# EAGLE design PCB_OnOnfre_SINGLE_BETA1 Solenoid (EAGLE 9.2.0)
CNAME: BH ONOFRE; CREVISION: 5.1; DESIGNER: BrunoHorta
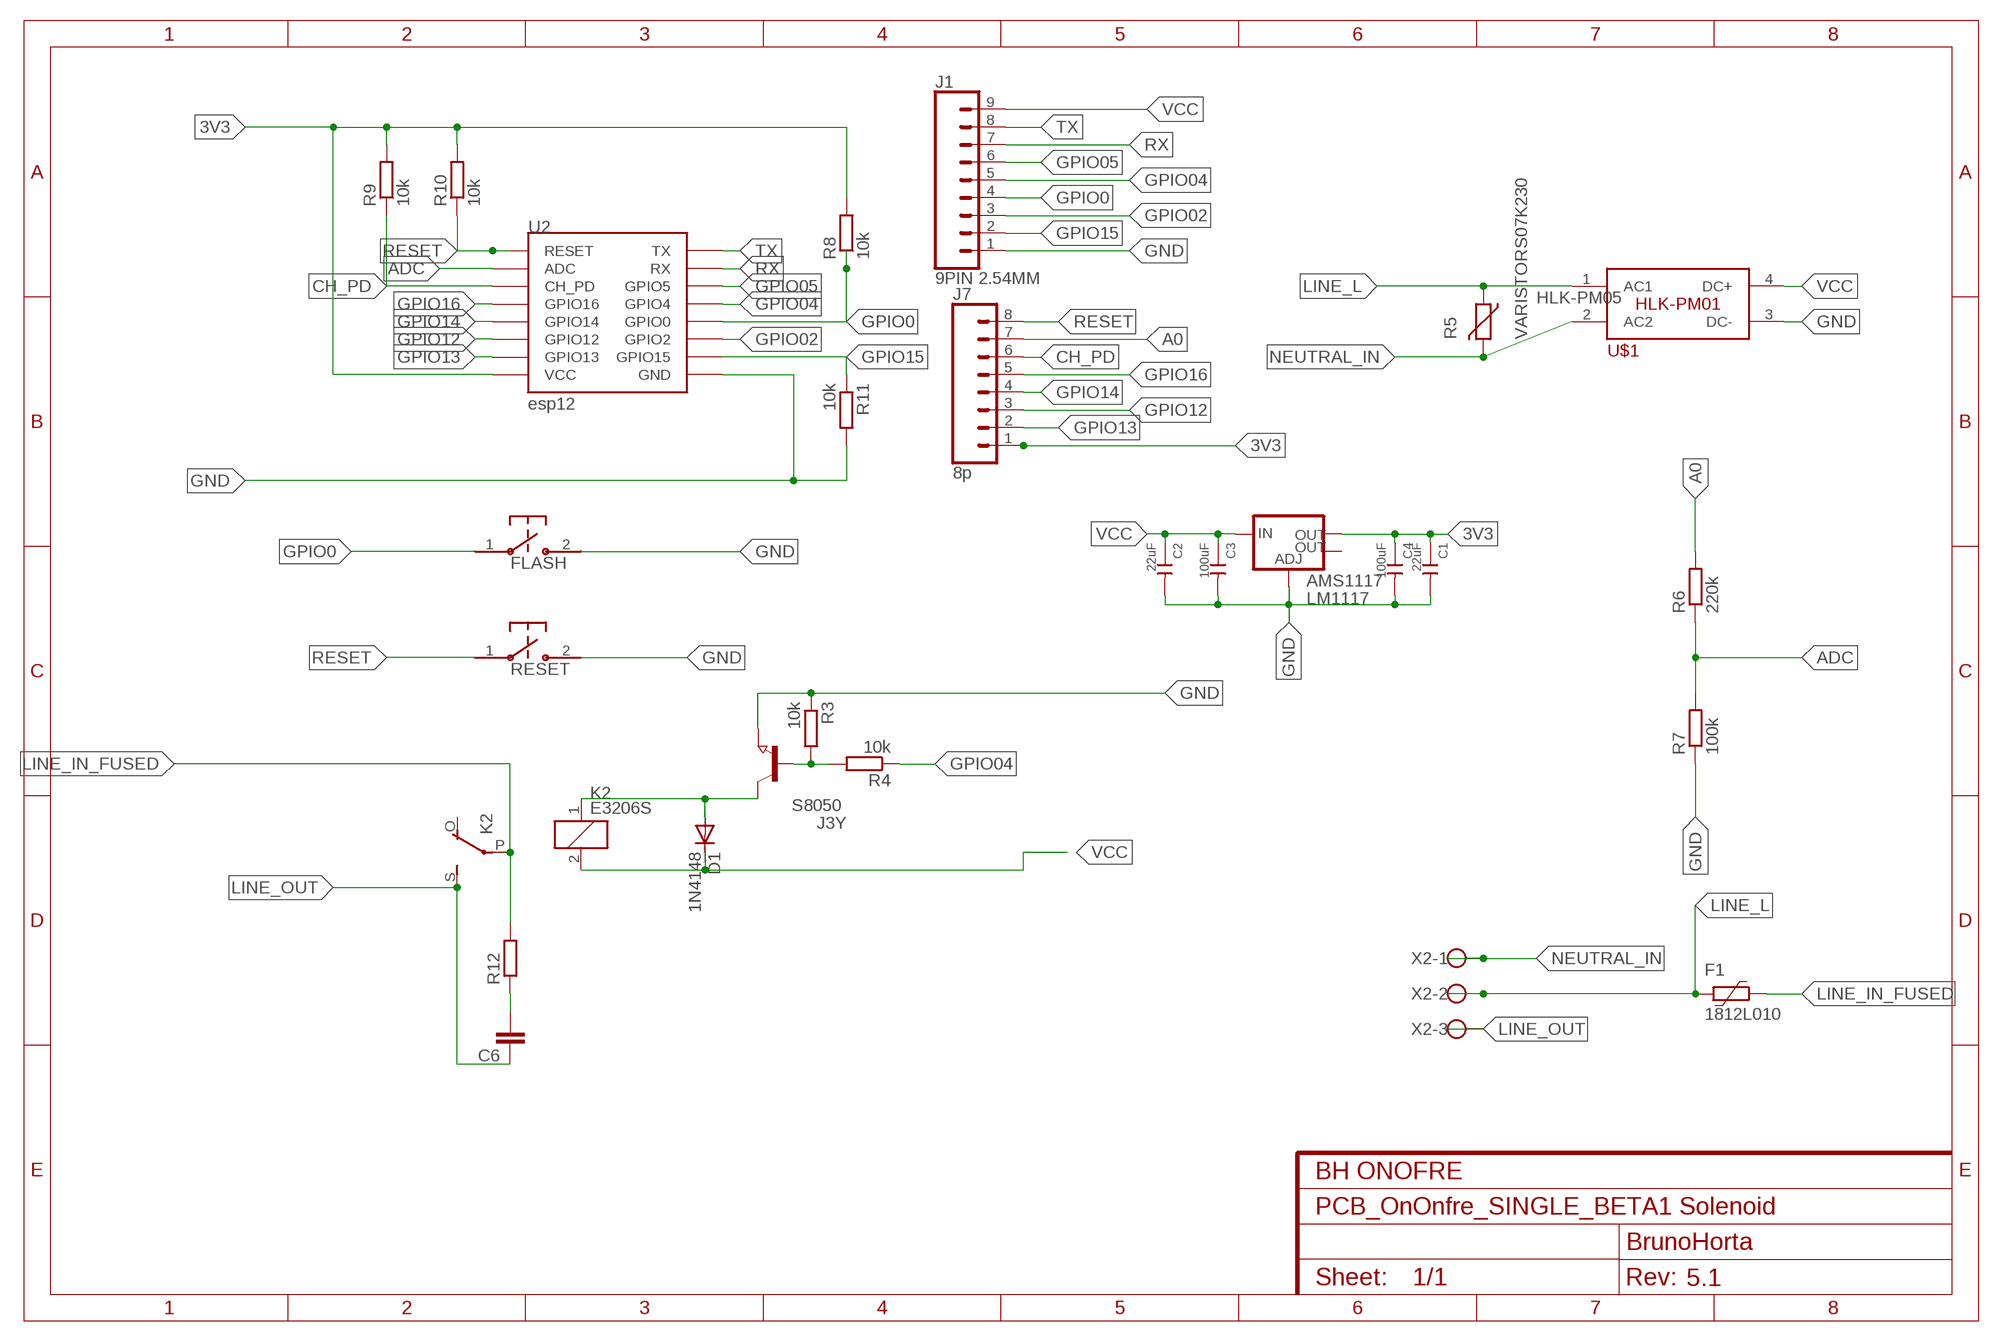
[diagram p0: schematic, sheet 1]

## Parts
AMS1117  LM1117  V_REG_LM1117SOT223  [SOT223]
C1  22uF  CERAMIC-1NF-1KV-10%-X7R(1206)  [C1206]
C2  22uF  CERAMIC-1NF-1KV-10%-X7R(1206)  [C1206]
C3  100uF  CERAMIC-1NF-1KV-10%-X7R(1206)  [C1206]
C4  100uF  CERAMIC-1NF-1KV-10%-X7R(1206)  [C1206]
C6  C-EU102-043X133  [C102-043X133]
D1  1N4148  DIODE-SOD80C  [SOD80C]
F1  1812L010  [1812L]
FLASH  B3U-1000P-2P-SMD  B3U-1000P  [B3U-1000P]
J1  9PIN 2.54MM  CONN_09  [1X09]
J3Y  S8050  NPN-TRANSISTOR_SOT23  [SOT23]
J7  8p  CONN_08"  [1X08]
K2  E3206S  [E3206S]
R3  10k  R-EU_R0603  [R0603]
R4  10k  R-EU_R0603  [R0603]
R5  VARISTORS07K230  [S07K230]
R6  220k  R-EU_R0603  [R0603]
R7  100k  R-EU_R0603  [R0603]
R8  10k  R-EU_R0603  [R0603]
R9  10k  R-EU_R0603  [R0603]
R10  10k  R-EU_R0603  [R0603]
R11  10k  R-EU_R0603  [R0603]
R12  R-EU_R2512  [R2512]
RESET  B3U-1000P-2P-SMD  B3U-1000P  [B3U-1000P]
U2  esp12  ESP12SMD  [ESP12-SMD]
U$1  HLK-PM01  [HLK-PM01]
X2  W237-103  [W237-103]

## Nets
3V3: AMS1117.2(OUT) C1.1 C4.1 J7.1 R8.2 R9.2 R10.2 U2.VCC
A0: J7.7 R6.2
ADC: R6.1 R7.2 U2.ADC
CH_PD: J7.6 R9.1 U2.CH_PD
GND: AMS1117.1(ADJ) C1.2 C2.2 C3.2 C4.2 FLASH.2 J1.1 J3Y.2(E) R3.1 R7.1 R11.2 RESET.2 U2.GND U$1.3(DC-)
GPIO0: FLASH.1 J1.4 R8.1 U2.GPIO0
GPIO02: J1.3 U2.GPIO2
GPIO04: J1.5 R4.1 U2.GPIO4
GPIO05: J1.6 U2.GPIO5
GPIO12: J7.3 U2.GPIO12
GPIO13: J7.2 U2.GPIO13
GPIO14: J7.4 U2.GPIO14
GPIO15: J1.2 R11.1 U2.GPIO15
GPIO16: J7.5 U2.GPIO16
LINE_IN_FUSED [220V]: F1.1 K2.P(2:P) R12.2
LINE_L [220V]: F1.2 R5.1 U$1.1(AC1) X2.2
LINE_OUT [220V]: C6.1 K2.S(2:S) X2.3
N$1: D1.A J3Y.3(C) K2.1
N$5: C6.2 R12.1
N$7: J3Y.1(B) R3.2 R4.2
NEUTRAL_IN [220V]: R5.2 U$1.2(AC2) X2.1
RESET: J7.8 R10.1 RESET.1 U2.RESET
RX: J1.7 U2.RXD0(RX)
TX: J1.8 U2.TXD0(TX)
VCC: AMS1117.3(IN) C2.1 C3.1 D1.C J1.9 K2.2 U$1.4(DC+)
Unconnected: AMS1117.4(OUT) K2.O(2:O)

## Notes on the sheet
- HLK-PM05

## Library data of the parts
AMS1117 = SparkFun-IC-Power:V_REG_LM1117: Voltage Regulator LM1117 Standard adjustable voltage regulator but in SMD form. Spark Fun Electronics SKU : COM-00595; PROD_ID: VREG-08170
C1-C4 = Seeed-Capacitor:CERAMIC-1NF-1KV-10%-X7R?(1206): 302010189; MPN: CC1206KKX7RCBB102; VALUE: 1NF
C6 = rcl:C-EU: CAPACITOR, European symbol; SPICEPREFIX: C
D1 = diode:DIODE-: DIODE
F1 = polyfuse-smd_10:?: Polyfuse Resettable PTC Source: http://www.littelfuse.com/products/resettable-ptcs.aspx; MF: Littelfuse; MPN: 1812L010; OC_FARNELL: 1822210; OC_NEWARK: 78R5551
FLASH RESET = switches:B3U: Switch; DIGIKEY: SW1020CT-ND; MANUFACTURER: Omron; MPN: B3U-1000P
J1 = SparkFun-Connectors:CONN_09: Multi connection point. Often used as Generic Header-pin footprint for 0.1 inch spaced/style header connections On any of the 0.1 inch spaced packages, you can populate with these: Break Away Headers - Straight <https://www.sparkfun.com/products/116> (PRT-00116) Break Away Male Headers - Right Angle <https://www.sparkfun.com/products/553> (PRT-00553) Female Headers <https://www.sparkfun.com/products/115> (PRT-00115) Break Away Headers - Machine Pin <https://www.sparkfun.com/products/117> (PRT-00117) Break Away Female Headers - Swiss Machine Pin <https://www.sparkfun.com/products/743> (PRT-00743) For SCREWTERMINALS and SPRING TERMINALS visit here: Screw Terimnals on SparkFun.com <https://www.sparkfun.com/search/results?term=Screw+Terminals> (5mm/3.5mm/2.54mm spacing) This device is also useful as a general connection point to wire up your design to another part of your project. Our various solder wires solder well into these plated through hole pads. Hook-Up Wire - Assortment (Stranded, 22 AWG) <https://www.sparkfun.com/products/11375> (PRT-11375) Hook-Up Wire - Assortment (Solid Core, 22 AWG) <https://www.sparkfun.com/products/11367> (PRT-11367) View the entire wire category on our website here <https://www.sparkfun.com/categories/141> Special notes: Molex polarized connector foot print use with SKU : PRT-08231 with associated crimp pins and housings. 1MM SMD Version SKU: PRT-10208 NOTES ON THE VARIANTS LOCK and LOCK_LONGPADS... This footprint was designed to help hold the alignment of a through-hole component (i.e. 6-pin header) while soldering it into place. You may notice that each hole has been shifted either up or down by 0.005 of an inch from it's more standard position (which is a perfectly straight line). This slight alteration caused the pins (the squares in the middle) to touch the edges of the holes. Because they are alternating, it causes a "brace" to hold the component in place. 0.005 has proven to be the perfect amount of "off-center" position when using our standard breakaway headers. Although looks a little odd when you look at the bare footprint, once you have a header in there, the alteration is very hard to notice. Also,if you push a header all the way into place, it is covered up entirely on the bottom side.
J3Y = semicon-smd-ipc:NPN-TRANSISTOR_: NPN TRANSISTOR
J7 = SparkFun-Connectors:CONN_08: Multi connection point. Often used as Generic Header-pin footprint for 0.1 inch spaced/style header connections On any of the 0.1 inch spaced packages, you can populate with these: Break Away Headers - Straight <https://www.sparkfun.com/products/116> (PRT-00116) Break Away Male Headers - Right Angle <https://www.sparkfun.com/products/553> (PRT-00553) Female Headers <https://www.sparkfun.com/products/115> (PRT-00115) Break Away Headers - Machine Pin <https://www.sparkfun.com/products/117> (PRT-00117) Break Away Female Headers - Swiss Machine Pin <https://www.sparkfun.com/products/743> (PRT-00743) Arduino Stackable Header - 8 Pin <https://www.sparkfun.com/products/9279> (PRT-09279) For SCREWTERMINALS and SPRING TERMINALS visit here: Screw Terimnals on SparkFun.com <https://www.sparkfun.com/search/results?term=Screw+Terminals> (5mm/3.5mm/2.54mm spacing) This device is also useful as a general connection point to wire up your design to another part of your project. Our various solder wires solder well into these plated through hole pads. Hook-Up Wire - Assortment (Stranded, 22 AWG) <https://www.sparkfun.com/products/11375> (PRT-11375) Hook-Up Wire - Assortment (Solid Core, 22 AWG) <https://www.sparkfun.com/products/11367> (PRT-11367) View the entire wire category on our website here <https://www.sparkfun.com/categories/141> Special notes: Molex polarized connector foot print use with SKU : PRT-08231 with associated crimp pins and housings. 1MM SMD Version SKU: PRT-10208 NOTES ON THE VARIANTS LOCK and LOCK_LONGPADS... This footprint was designed to help hold the alignment of a through-hole component (i.e. 6-pin header) while soldering it into place. You may notice that each hole has been shifted either up or down by 0.005 of an inch from it's more standard position (which is a perfectly straight line). This slight alteration caused the pins (the squares in the middle) to touch the edges of the holes. Because they are alternating, it causes a "brace" to hold the component in place. 0.005 has proven to be the perfect amount of "off-center" position when using our standard breakaway headers. Although looks a little odd when you look at the bare footprint, once you have a header in there, the alteration is very hard to notice. Also,if you push a header all the way into place, it is covered up entirely on the bottom side.; PROD_ID: CONN-08438
K2 = relay:E3206S: RELAY 1 x switch, Eichhoff/distributor Schukat; OC_FARNELL: unknown; OC_NEWARK: unknown
R3 R4 R6-R12 = resistor:R-EU_: RESISTOR, European symbol
R5 = varistor:VARISTOR: VARISTOR
U2 = esp8266modules:ESP12: ESP8266 Wifi module 12
U$1 = HLK-PM01:HLK-PM01; AVAILABILITY: Unavailable; MF: Hi-link; MP: hlk-pm01; PACKAGE: Package Analog Devices; PRICE: None
X2 = con-wago-500:W237-103: WAGO SCREW CLAMP; MPN: 237-103; OC_FARNELL: unknown; OC_NEWARK: 18M7116

## Net classes
1 220V: width 1.27 mm, clearance 2 mm

## Board
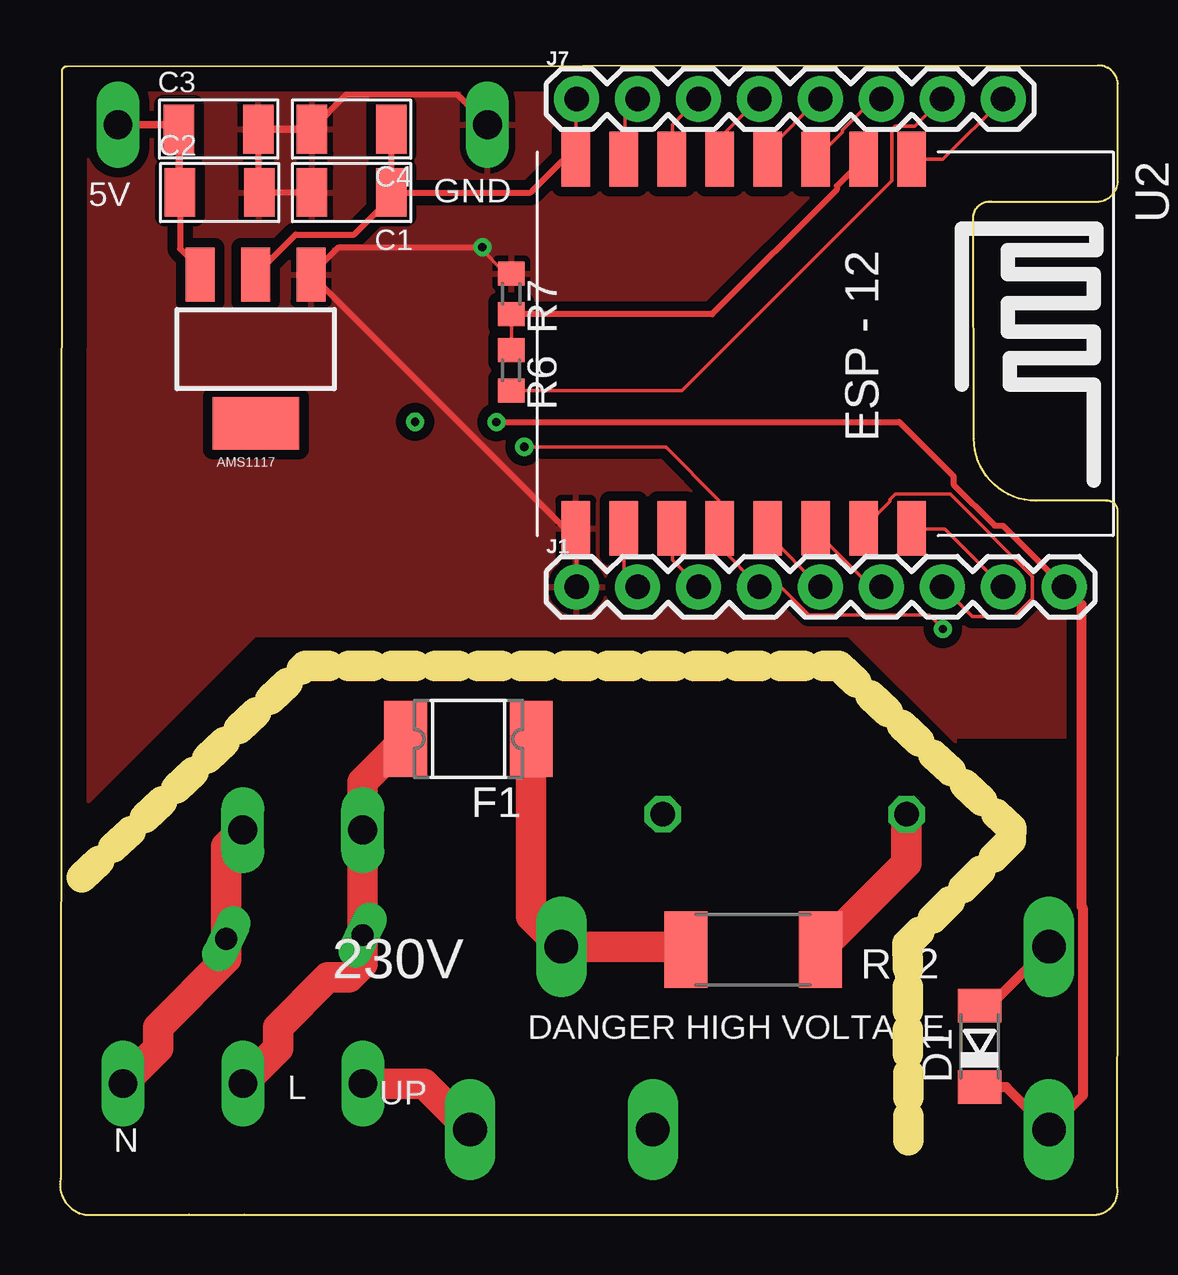
[diagram p1: board, top side]
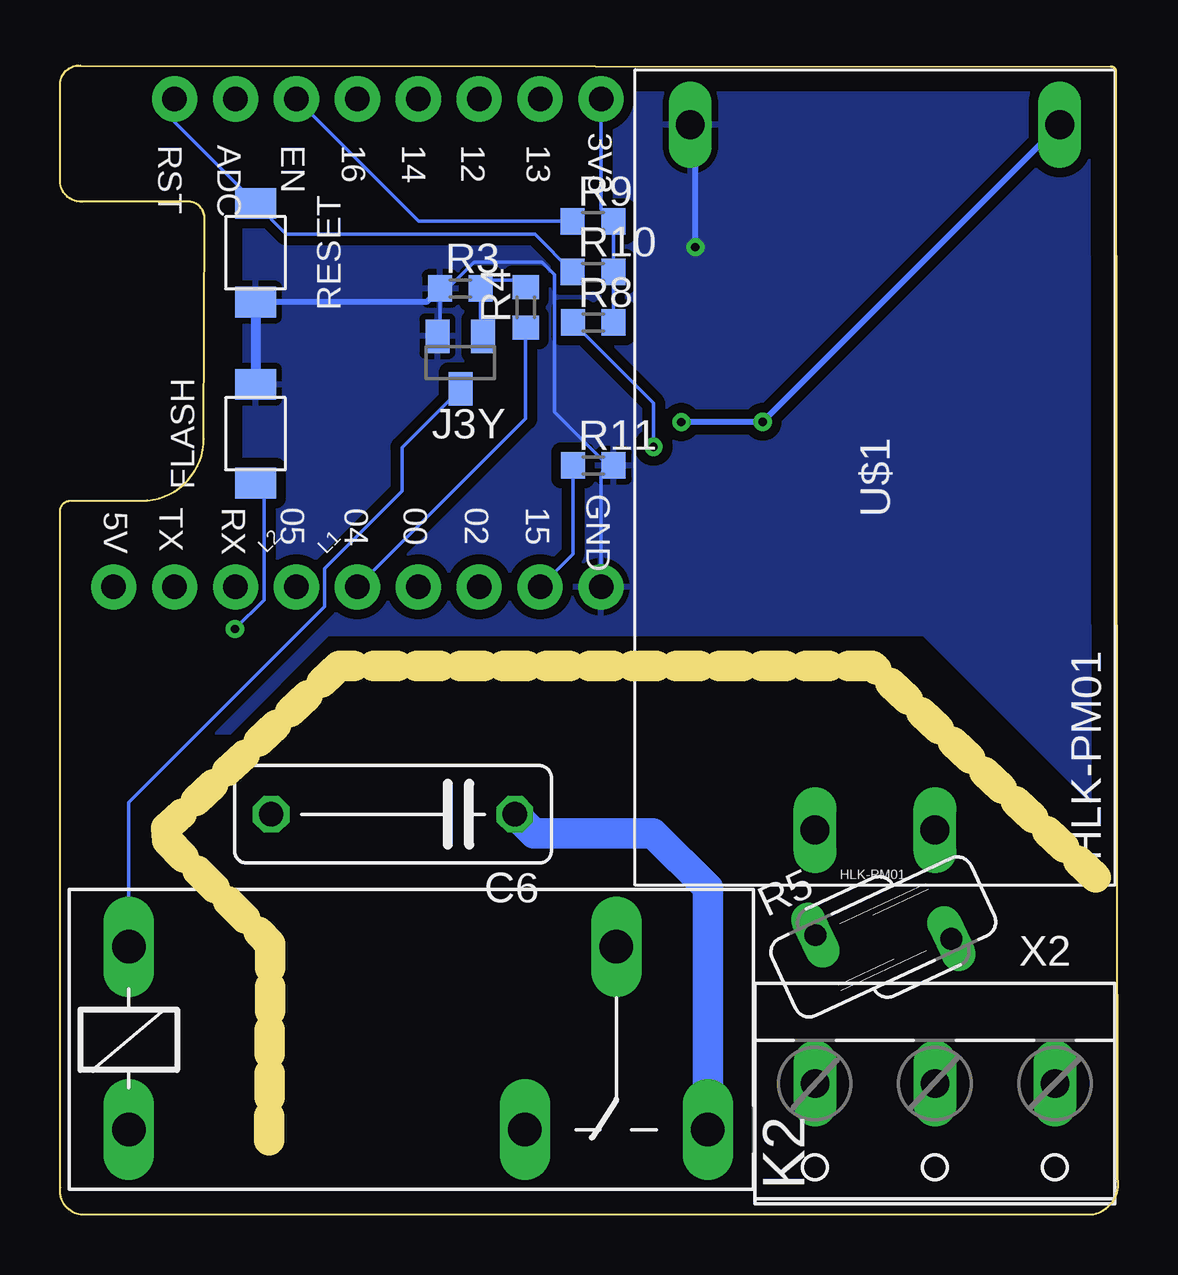
[diagram p2: board, bottom side, seen from below]

Size 44.09 x 47.9 mm. Coordinates in mm from the lower left corner, seen from the top.
Outline: 0.08,47.68 0.02,1.51 arc90 1.03,0 5.38,0 7.68,0 43.23,0 arc90 44.08,1.12 44.09,12.08 44.09,29.35 arc90 43.61,29.76 40.69,29.76 arc-90 38.1,32.35 38.07,41.61 arc-90 38.83,42.23 43.15,42.22 arc90 44.09,43.06 44.09,47.15 arc90 43.24,47.9 0.3,47.86 arc90 0.08,47.68
Copper layers (1*16): Top 0.035mm / dielectric 1.5mm / Bottom 0.035mm
Design rules "default": minimum track width 6mil, minimum drill 0.35mm, track to track 6mil, track to pad 6mil, pad to pad 6mil, via to via 6mil, smd to smd 6mil, copper to edge 40mil, drill to drill 6mil, minimum pad ring 10mil, minimum via ring 8mil, stop-mask expansion 4mil, vias tented up to drill 0mil, thermal gap 10mil
Milling: 37 lines

### Footprints (pad centres in the part's own frame; a part is rotated, then mirrored left to right if it is on the bottom)
SOT223 = smd 1.219 x 2.235: 1 -2.311,-3.099; 2 0,-3.099; 3 2.311,-3.099 | smd 3.6 x 2.2: 4 0,3.099
C1206 = smd 1.27 x 2.032: 1 -1.651,0; 2 1.651,0
C102-043X133 = drill 1.016 octagon: 1 -5.08,0; 2 5.08,0
SOD80C = smd 1.4 x 1.8: A 1.7,0; C -1.7,0
1812L = smd 1.78 x 3.15: 1 -2.62,0; 2 2.62,0
B3U-1000P = smd 1.283 x 1.7: 1 -2.056,0; 2 2.056,0
1X09 = drill 1.016 pad 1.88: 1 0,0; 2 2.54,0; 3 5.08,0; 4 7.62,0; 5 10.16,0; 6 12.7,0; 7 15.24,0; 8 17.78,0; 9 20.32,0
SOT23 = smd 1 x 1.4: 1 -0.95,-1.1; 2 0.95,-1.1; 3 0,1.1
1X08 = drill 1.016 pad 1.88: 1 0,0; 2 2.54,0; 3 5.08,0; 4 7.62,0; 5 10.16,0; 6 12.7,0; 7 15.24,0; 8 17.78,0
E3206S = drill 1.397 long: 1 -3.175,3.81; 2 -3.175,-3.81; O 13.335,-3.81; P 17.145,3.81; S 20.955,-3.81
R0603 = smd 1 x 1.1: 1 -0.85,0; 2 0.85,0
S07K230 = drill 0.914 long: 1 -1.27,-2.54; 2 1.27,2.54
R2512 = smd 1.8 x 3.2: 1 -2.8,0; 2 2.8,0
ESP12-SMD = smd 2.286 x 1.2: ADC -7.792,3.8; CH_PD -7.792,1.8; GND 7.592,-8.2; GPIO0 7.592,-2.2; GPIO2 7.592,-4.2; GPIO4 7.592,-0.2; GPIO5 7.592,1.8; GPIO12 -7.792,-4.2; GPIO13 -7.792,-6.2; GPIO14 -7.792,-2.2; GPIO15 7.592,-6.2; GPIO16 -7.792,-0.2; RESET -7.792,5.8; RXD0 7.592,3.8; TXD0 7.592,5.8; VCC -7.792,-8.2
HLK-PM01 = drill 1.2 long: 1 -14.7,2.5; 2 -14.7,-2.5; 3 14.7,7.7; 4 14.7,-7.7
W237-103 = drill 1.194 long: 1 -5,-1.29; 2 0,-1.29; 3 5,-1.29

### Placement (x,y rotation side)
AMS1117  8.16,36.09 180 top
C1  12.16,42.61 180 top
C2  6.66,42.61 0 top
C3  6.61,45.25 0 top
C4  12.16,45.25 180 top
C6  30.21,16.69 180 bottom
D1  38.34,7.02 90 top
F1  17.02,19.83 180 top
FLASH  35.94,32.56 90 bottom
J1  21.54,26.17 0 top
J3Y  27.41,35.52 180 bottom
J7  21.54,46.51 0 top
K2  38.05,7.36 0 bottom
R3  27.4,38.61 0 bottom
R4  24.68,37.82 90 bottom
R5  9.77,11.58 295 bottom
R6  18.81,35.19 270 top
R7  18.81,38.38 270 top
R8  21.86,37.19 0 bottom
R9  21.87,41.41 0 bottom
R10  21.87,39.3 0 bottom
R11  21.86,31.23 0 bottom
R12  28.9,11.05 180 top
RESET  35.94,40.1 270 bottom
U2  29.7,36.2 270 top
U$1  10.12,30.73 90 bottom
X2  7.62,4.17 180 bottom

### Tracks (layer width: path | path; a pad name or v marks a point on that pad's centre or on a via)
3V3
  Top 0.152: U2.VCC 21.5,44.49 21.5,46.47 J7.1 | 13.79,43.2 13.79,42.75 C1.1 13.8,42.78 13.79,43.2
  Top 0.254: C4.1 13.81,42.78 13.8,42.78 | C1.1 14.02,42.61 | 14.02,42.61 19.62,42.61 21.5,44.49 | AMS1117.2 9.83,40.85 12.26,40.85 14.02,42.61
  Bottom 0.152: R8.2 R10.2 21.02,41.4 | 21.02,41.4 R9.2 | R9.2 | J7.1 21.54,41.92 21.02,41.4
A0
  Top 0.152: J7.7 35.64,45.37 34.81,45.37 34.67,45.23 34.67,43.1 25.92,34.34 R6.2
ADC
  Top 0.152: R7.2 R6.1
  Top 0.254: U2.ADC 32.38,42.87 32.38,42.74 27.18,37.53 R7.2
CH_PD
  Top 0.152: U2.CH_PD 31.55,44.06 32.62,45.12 32.62,45.2 33.91,46.49 34.22,46.49 J7.6
  Bottom 0.152: R9.1 29.14,41.41 J7.6
GND  (via drill 0.35)
  Top 0.152: U2.GND arc-90 21.54,28.57 21.54,27.76 J1.1 | R7.1 18.58,39.23 17.48,40.33
  Top 0.254: C4.2 11.95,46.7 16.45,46.7 16.55,46.7 U$1.3 | C3.2 8.26,42.65 C2.2 C1.2 | v17.61,40.33 17.48,40.33 11.62,40.33 AMS1117.1 21.54,28.12 21.54,27.76
  Top 0.305: C3.2 C4.2
  Bottom 0.152: J1.1 21.54,30.8 arc90 R11.2 21.26,31.25 23.47,33.46 23.47,39.18 24.01,39.71 26.82,39.71 27.89,38.64 28.2,38.64 R3.1 28.25,36.72 J3Y.2
  Bottom 0.254: v17.61,40.33 17.61,45.22 U$1.3 | R3.1 28.82,38.04 RESET.2
  Bottom 0.406: RESET.2 FLASH.2
  pour Top (isolate 0.406): 0.26,47.54 0.26,18.16 1.21,17.21 8.14,24.14 32.87,24.14 37.31,19.7 37.31,19.92 42.95,19.92 43.75,20.72 43.75,27.24 42.06,28.93 36.82,28.93 36.82,42.55 38.52,44.24 42.64,44.24 42.6,44.28 42.6,47.58 0.3,47.58
  pour Bottom (isolate 0.406): 0.22,47.5 0.22,17.71 0.92,17.01 8.09,24.19 32.91,24.19 37,20.09 43.71,20.09 43.71,27.28 42.02,28.97 37.07,28.97 36.41,29.63 36.41,42.3 38.39,44.28 42.47,44.28 42.56,44.36 42.56,47.74 0.46,47.74 0.26,47.54
GPIO0  (via drill 0.35)
  Top 0.152: v36.8,24.42 36.72,24.5 36.72,24.52 36.23,25 31.21,25 30.05,26.17 J1.4 27.5,27.83 27.5,28.22 | 27.5,28.22 U2.GPIO0 | v19.35,32.01 25.25,32.01 27.48,29.78 27.48,28.25 27.5,28.22
  Bottom 0.152: FLASH.1 35.59,30.49 35.59,25.63 v36.8,24.42 | R8.1 19.35,33.83 v19.35,32.01
GPIO02
  Top 0.152: U2.GPIO2 25.53,28.59 25.53,27.29 26.6,26.22 J1.3
GPIO04
  Top 0.152: U2.GPIO4 29.57,28.59 29.57,28.28 31.63,26.22 J1.5
  Bottom 0.152: R4.1 24.68,33.18 J1.5
GPIO05
  Top 0.152: U2.GPIO5 31.55,28.59 31.55,28.43 33.76,26.22 34.22,26.22 J1.6
GPIO12
  Top 0.152: U2.GPIO12 25.53,44.06 25.53,45.43 26.6,46.49 J7.3
GPIO13
  Top 0.152: U2.GPIO13 23.55,44.06 23.55,46.04 24.01,46.49 J7.2
GPIO14
  Top 0.152: U2.GPIO14 27.51,44.06 27.51,44.89 29.11,46.49 J7.4
GPIO15
  Top 0.152: U2.GPIO15 23.5,26.75 J1.2
  Bottom 0.152: R11.1 22.71,27.54 J1.2
GPIO16
  Top 0.152: U2.GPIO16 29.57,44.06 29.57,44.44 31.63,46.49 J7.5
LINE_IN_FUSED
  Top 1.27: R12.2 25.99,11.17 K2.P 19.64,12.43 F1.1
LINE_L
  Top 1.27: F1.2 12.62,18.05 U$1.1 12.61,16.02 R5.1 12.61,10.45 12.05,9.89 11.16,9.89 9.09,7.82 9.09,6.93 X2.2
LINE_OUT
  Top 1.27: X2.3 15.18,5.46 K2.S
  Bottom 1.27: C6.1 24.34,15.9 19.38,15.9 17.09,13.61 K2.S
N$1
  Top 0.406: K2.1 38.77,8.72 D1.A
  Bottom 0.152: J3Y.3 29.84,31.99 29.84,30.16 33.06,26.94 33.06,25.36 41.22,17.2 K2.1
N$5
  Top 1.27: C6.2 35.29,14.65 R12.1
N$7
  Bottom 0.152: J3Y.1 26.55,36.71 R3.2 26.52,38.64 26.21,38.95 24.69,38.95 R4.2
NEUTRAL_IN
  Top 1.27: U$1.2 6.93,15.35 R5.2 6.93,10.66 4.09,7.82 4.09,6.93 X2.1
RESET
  Top 0.152: U2.RESET 36.81,43.99 J7.8
  Bottom 0.152: R10.1 24.3,40.88 34.66,40.88 RESET.1 39.32,45.53 J7.8
RX
  Top 0.152: U2.RXD0 33.53,28.66 34.6,29.73 34.6,29.81 34.83,30.03 37.11,30.03 40.54,26.61 40.54,25.69 39.78,24.93 38.03,24.93 36.81,26.15 J1.7
TX
  Top 0.152: U2.TXD0 35.51,28.59 36.88,28.59 39.25,26.22 J1.8
VCC  (via drill 0.35)
  Top 0.152: AMS1117.3 5.85,39.42 5.8,39.47 | C3.1 4.96,45.57 C3.1
  Top 0.254: C2.1 5.01,40.27 5.8,39.47 | v18.19,33.04 34.99,33.04 37.24,30.79 37.24,30.44 38.96,28.72 39.3,28.72 J1.9 42.58,25.45
  Top 0.305: U$1.4 4.66,45.43 C3.1 4.96,42.65 C2.1
  Top 0.406: D1.C 39.45,5.32 K2.2 42.63,4.95 42.63,12.8 42.58,12.84 42.58,25.45
  Bottom 0.254: U$1.4 v14.8,33.05 14.81,33.04 v18.19,33.04

### Text on the board
tNames: 5V | GND | 230V | DANGER HIGH VOLTAGE | UP | L | N
bNames: 3V3 | 13 | 12 | 14 | 16 | EN | ADC | RST | GND | 15 | 02 | 00 | 04 | 05 | RX | TX | 5V | L1 | L2 | HLK-PM01